# EAGLE design strip_charlie_30 (EAGLE 5.11)
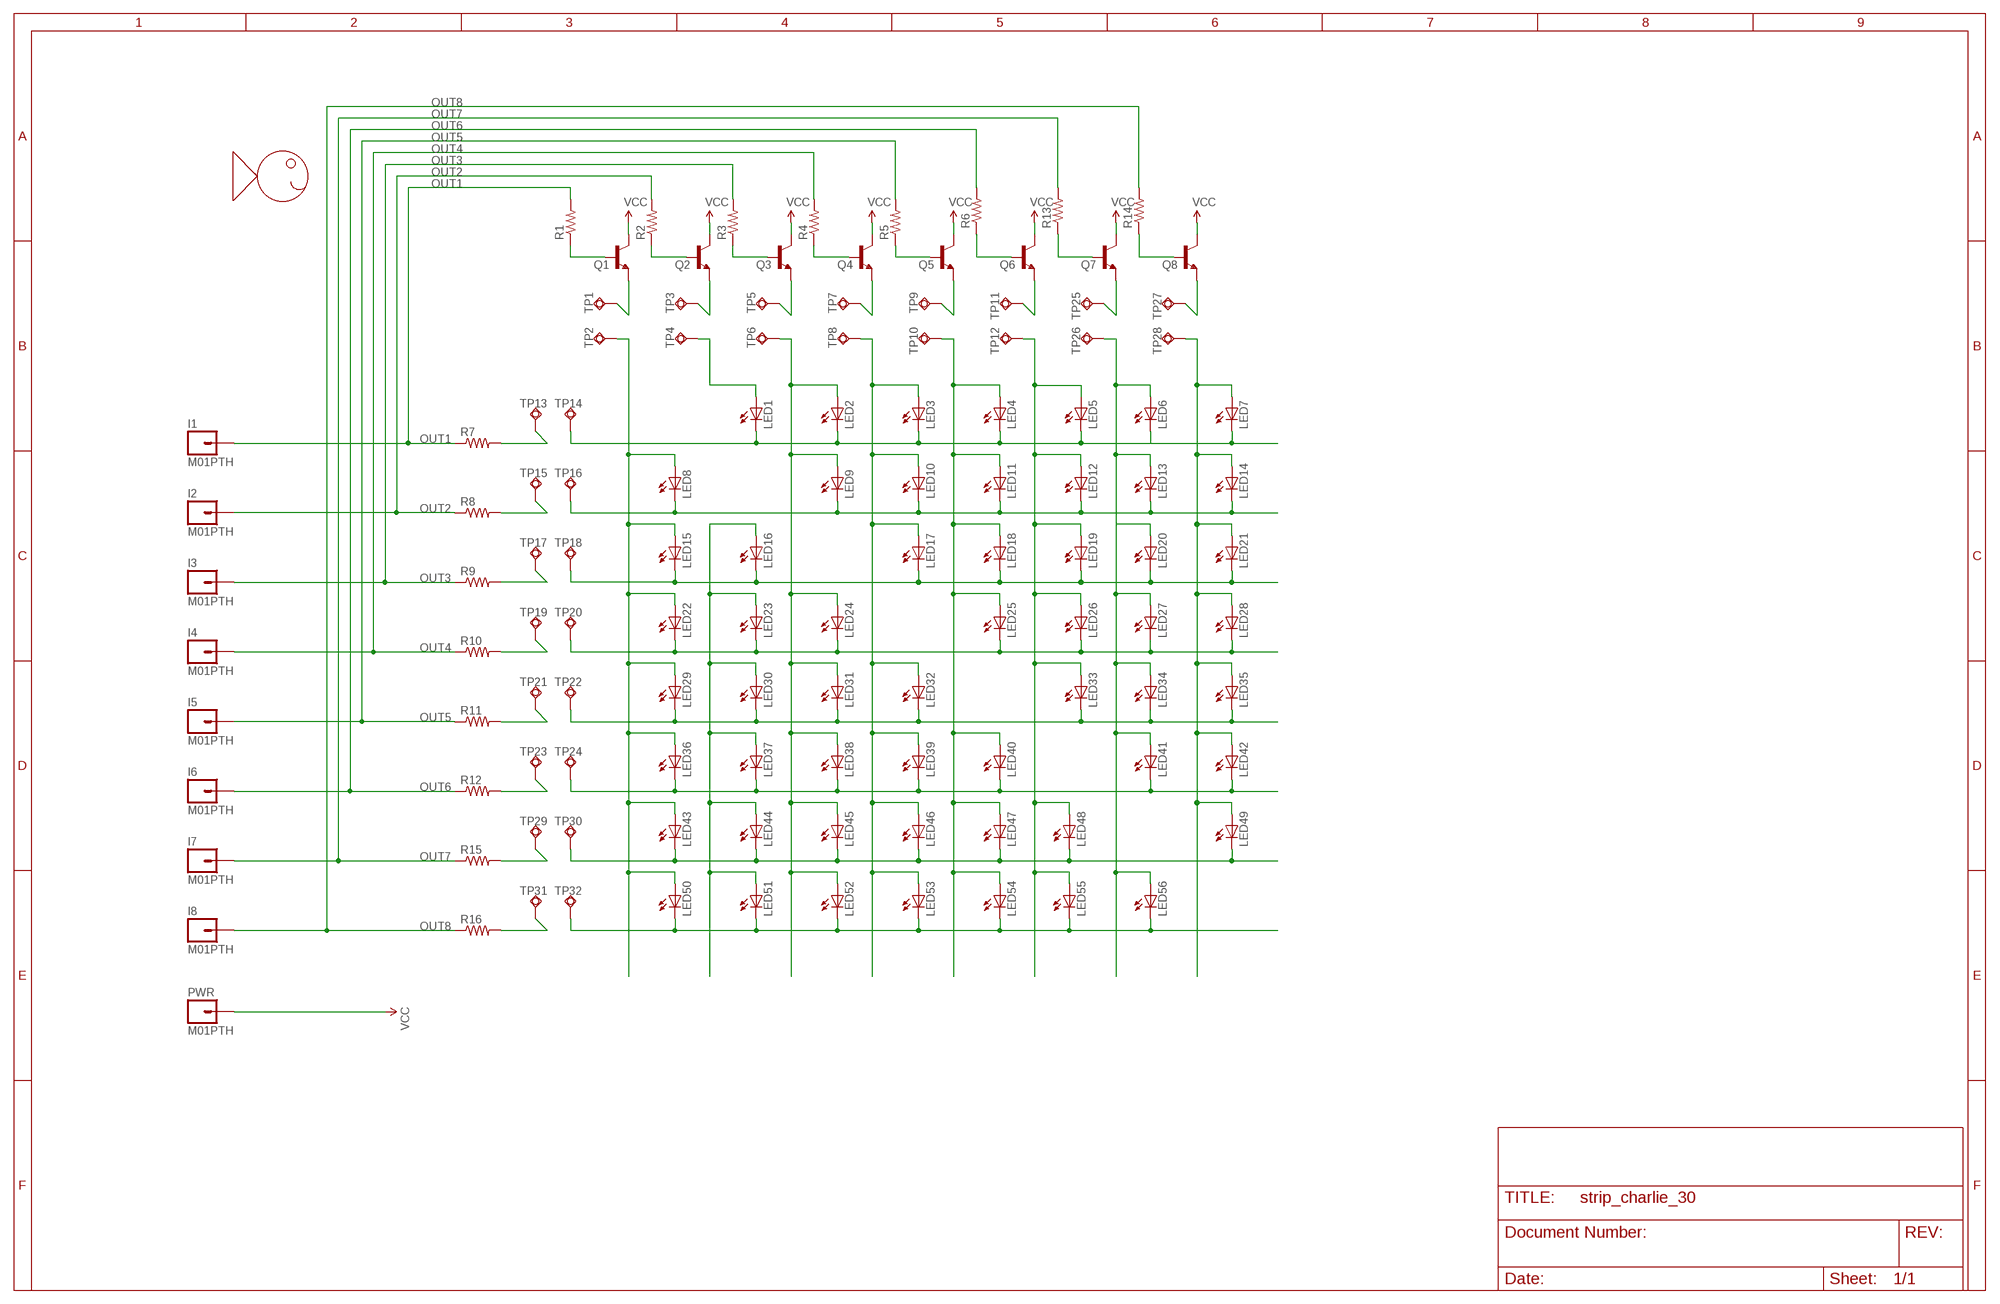
[diagram p0: schematic, sheet 1]

## Parts
I1  M01PTH  [1X01]
I2  M01PTH  [1X01]
I3  M01PTH  [1X01]
I4  M01PTH  [1X01]
I5  M01PTH  [1X01]
I6  M01PTH  [1X01]
I7  M01PTH  [1X01]
I8  M01PTH  [1X01]
LED1  LED1206  [LED-1206]
LED2  LED1206  [LED-1206]
LED3  LED1206  [LED-1206]
LED4  LED1206  [LED-1206]
LED5  LED1206  [LED-1206]
LED6  LED1206  [LED-1206]
LED7  LED1206  [LED-1206]
LED8  LED1206  [LED-1206]
LED9  LED1206  [LED-1206]
LED10  LED1206  [LED-1206]
LED11  LED1206  [LED-1206]
LED12  LED1206  [LED-1206]
LED13  LED1206  [LED-1206]
LED14  LED1206  [LED-1206]
LED15  LED1206  [LED-1206]
LED16  LED1206  [LED-1206]
LED17  LED1206  [LED-1206]
LED18  LED1206  [LED-1206]
LED19  LED1206  [LED-1206]
LED20  LED1206  [LED-1206]
LED21  LED1206  [LED-1206]
LED22  LED1206  [LED-1206]
LED23  LED1206  [LED-1206]
LED24  LED1206  [LED-1206]
LED25  LED1206  [LED-1206]
LED26  LED1206  [LED-1206]
LED27  LED1206  [LED-1206]
LED28  LED1206  [LED-1206]
LED29  LED1206  [LED-1206]
LED30  LED1206  [LED-1206]
LED31  LED1206  [LED-1206]
LED32  LED1206  [LED-1206]
LED33  LED1206  [LED-1206]
LED34  LED1206  [LED-1206]
LED35  LED1206  [LED-1206]
LED36  LED1206  [LED-1206]
LED37  LED1206  [LED-1206]
LED38  LED1206  [LED-1206]
LED39  LED1206  [LED-1206]
LED40  LED1206  [LED-1206]
LED41  LED1206  [LED-1206]
LED42  LED1206  [LED-1206]
LED43  LED1206  [LED-1206]
LED44  LED1206  [LED-1206]
LED45  LED1206  [LED-1206]
LED46  LED1206  [LED-1206]
LED47  LED1206  [LED-1206]
LED48  LED1206  [LED-1206]
LED49  LED1206  [LED-1206]
LED50  LED1206  [LED-1206]
LED51  LED1206  [LED-1206]
LED52  LED1206  [LED-1206]
LED53  LED1206  [LED-1206]
LED54  LED1206  [LED-1206]
LED55  LED1206  [LED-1206]
LED56  LED1206  [LED-1206]
PWR  M01PTH  [1X01]
Q1  TRANSISTOR_NPNSOT23-3  [SOT23-3]
Q2  TRANSISTOR_NPNSOT23-3  [SOT23-3]
Q3  TRANSISTOR_NPNSOT23-3  [SOT23-3]
Q4  TRANSISTOR_NPNSOT23-3  [SOT23-3]
Q5  TRANSISTOR_NPNSOT23-3  [SOT23-3]
Q6  TRANSISTOR_NPNSOT23-3  [SOT23-3]
Q7  TRANSISTOR_NPNSOT23-3  [SOT23-3]
Q8  TRANSISTOR_NPNSOT23-3  [SOT23-3]
R1  RESISTORR0805  [R0805]
R2  RESISTORR0805  [R0805]
R3  RESISTORR0805  [R0805]
R4  RESISTORR0805  [R0805]
R5  RESISTORR0805  [R0805]
R6  RESISTORR0805  [R0805]
R7  RESISTORR0805  [R0805]
R8  RESISTORR0805  [R0805]
R9  RESISTORR0805  [R0805]
R10  RESISTORR0805  [R0805]
R11  RESISTORR0805  [R0805]
R12  RESISTORR0805  [R0805]
R13  RESISTORR0805  [R0805]
R14  RESISTORR0805  [R0805]
R15  RESISTORR0805  [R0805]
R16  RESISTORR0805  [R0805]
TP1  TPSQTP20SQ  [TP20SQ]
TP2  TPSQTP20SQ  [TP20SQ]
TP3  TPSQTP20SQ  [TP20SQ]
TP4  TPSQTP20SQ  [TP20SQ]
TP5  TPSQTP20SQ  [TP20SQ]
TP6  TPSQTP20SQ  [TP20SQ]
TP7  TPSQTP20SQ  [TP20SQ]
TP8  TPSQTP20SQ  [TP20SQ]
TP9  TPSQTP20SQ  [TP20SQ]
TP10  TPSQTP20SQ  [TP20SQ]
TP11  TPSQTP20SQ  [TP20SQ]
TP12  TPSQTP20SQ  [TP20SQ]
TP13  TPSQTP20SQ  [TP20SQ]
TP14  TPSQTP20SQ  [TP20SQ]
TP15  TPSQTP20SQ  [TP20SQ]
TP16  TPSQTP20SQ  [TP20SQ]
TP17  TPSQTP20SQ  [TP20SQ]
TP18  TPSQTP20SQ  [TP20SQ]
TP19  TPSQTP20SQ  [TP20SQ]
TP20  TPSQTP20SQ  [TP20SQ]
TP21  TPSQTP20SQ  [TP20SQ]
TP22  TPSQTP20SQ  [TP20SQ]
TP23  TPSQTP20SQ  [TP20SQ]
TP24  TPSQTP20SQ  [TP20SQ]
TP25  TPSQTP20SQ  [TP20SQ]
TP26  TPSQTP20SQ  [TP20SQ]
TP27  TPSQTP20SQ  [TP20SQ]
TP28  TPSQTP20SQ  [TP20SQ]
TP29  TPSQTP20SQ  [TP20SQ]
TP30  TPSQTP20SQ  [TP20SQ]
TP31  TPSQTP20SQ  [TP20SQ]
TP32  TPSQTP20SQ  [TP20SQ]
U$1  FHI_LOGO  [FHI_LOGO]

## Nets
N$1: Q7.1(B) R13.1
N$2: Q8.1(B) R14.1
N$11: Q6.1(B) R6.1
N$14: LED16.A LED23.A LED30.A LED37.A LED44.A LED51.A
N$15: Q1.1(B) R1.1
N$16: Q2.1(B) R2.1
N$17: Q3.1(B) R3.1
N$18: Q4.1(B) R4.1
N$19: Q5.1(B) R5.1
OUT1: I1.1 R1.2 R7.1
OUT1_1: Q1.2(E) TP1.TP
OUT1_2: LED8.A LED15.A LED22.A LED29.A LED36.A LED43.A LED50.A TP2.TP
OUT1_3: R7.2 TP13.TP
OUT1_4: LED1.C LED2.C LED3.C LED4.C LED5.C LED6.C LED7.C TP14.TP
OUT2: I2.1 R2.2 R8.1
OUT2_1: Q2.2(E) TP3.TP
OUT2_2: LED1.A TP4.TP
OUT2_3: R8.2 TP15.TP
OUT2_4: LED8.C LED9.C LED10.C LED11.C LED12.C LED13.C LED14.C TP16.TP
OUT3: I3.1 R3.2 R9.1
OUT3_1: Q3.2(E) TP5.TP
OUT3_2: LED2.A LED9.A LED24.A LED31.A LED38.A LED45.A LED52.A TP6.TP
OUT3_3: R9.2 TP17.TP
OUT3_4: LED15.C LED16.C LED17.C LED18.C LED19.C LED20.C LED21.C TP18.TP
OUT4: I4.1 R4.2 R10.1
OUT4_1: Q4.2(E) TP7.TP
OUT4_2: LED3.A LED10.A LED17.A LED32.A LED39.A LED46.A LED53.A TP8.TP
OUT4_3: R10.2 TP19.TP
OUT4_4: LED22.C LED23.C LED24.C LED25.C LED26.C LED27.C LED28.C TP20.TP
OUT5: I5.1 R5.2 R11.1
OUT5_1: Q5.2(E) TP9.TP
OUT5_2: LED4.A LED11.A LED18.A LED25.A LED40.A LED47.A LED54.A TP10.TP
OUT5_3: R11.2 TP21.TP
OUT5_4: LED29.C LED30.C LED31.C LED32.C LED33.C LED34.C LED35.C TP22.TP
OUT6: I6.1 R6.2 R12.1
OUT6_1: Q6.2(E) TP11.TP
OUT6_2: LED5.A LED12.A LED19.A LED26.A LED33.A LED48.A LED55.A TP12.TP
OUT6_3: R12.2 TP23.TP
OUT6_4: LED36.C LED37.C LED38.C LED39.C LED40.C LED41.C LED42.C TP24.TP
OUT7: I7.1 R13.2 R15.1
OUT7_1: Q7.2(E) TP25.TP
OUT7_2: LED6.A LED13.A LED20.A LED27.A LED34.A LED41.A LED56.A TP26.TP
OUT7_3: R15.2 TP29.TP
OUT7_4: LED43.C LED44.C LED45.C LED46.C LED47.C LED48.C LED49.C TP30.TP
OUT8: I8.1 R14.2 R16.1
OUT8_1: Q8.2(E) TP27.TP
OUT8_2: LED7.A LED14.A LED21.A LED28.A LED35.A LED42.A LED49.A TP28.TP
OUT8_3: R16.2 TP31.TP
OUT8_4: LED50.C LED51.C LED52.C LED53.C LED54.C LED55.C LED56.C TP32.TP
VCC: PWR.1 Q1.3(C) Q2.3(C) Q3.3(C) Q4.3(C) Q5.3(C) Q6.3(C) Q7.3(C) Q8.3(C)

## Library data of the parts
I1-I8 PWR = SparkFun:M01: Header 1 Standard 1-pin 0.1" header. Use with straight break away headers (SKU : PRT-00116), right angle break away headers (PRT-00553), swiss pins (PRT-00743), machine pins (PRT-00117), and female headers (PRT-00115).
LED1-LED56 = CyberRailGuru:LED: LEDs Standard schematic elements and footprints for 5mm, 3mm, 1206, and 0603 sized LEDs. 5mm - Spark Fun Electronics SKU : COM-00529 (and others)
Q1-Q8 = SparkFun:TRANSISTOR_NPN: Transistor NPN BJT configuration in SOT23 package. MMBT2222 is the common NPN we use. Double check BCE configuration again layout.
R1-R16 = CyberRailGuru:RESISTOR: RESISTOR, American symbol
TP1-TP32 = CyberRailGuru:TPSQ: Test pad
U$1 = CyberRailGuru:FHI_LOGO: Fishhead Industries Logo

## Board
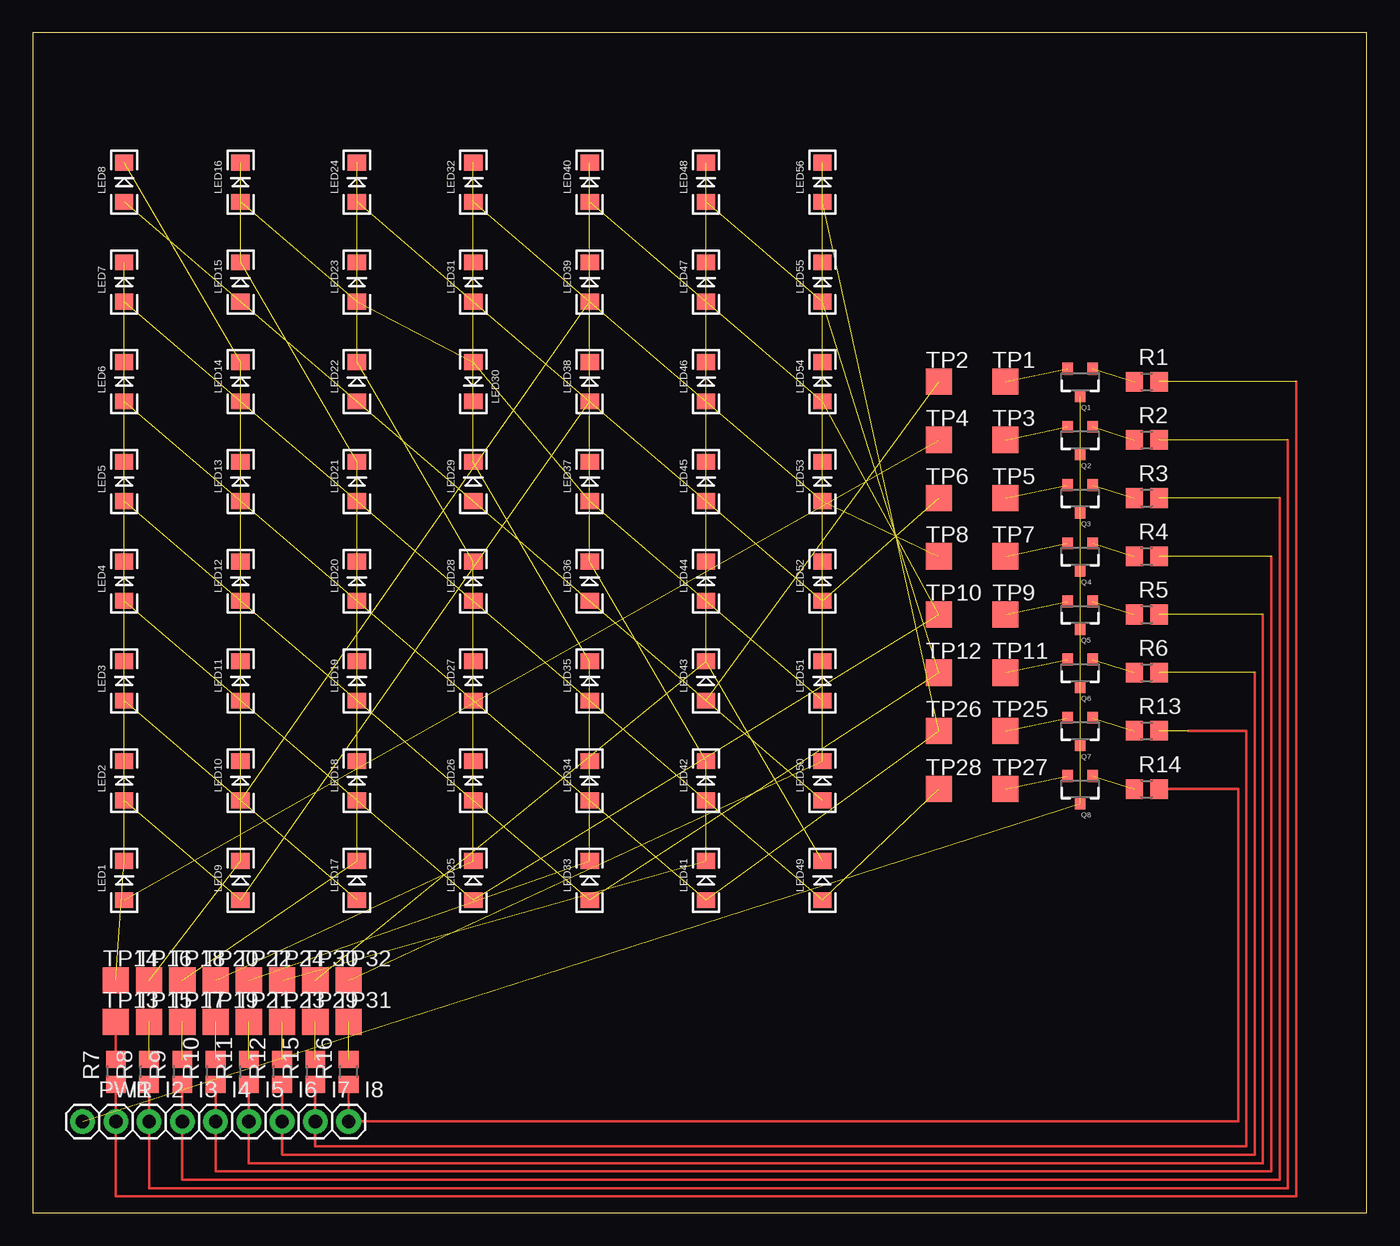
[diagram p1: board, top side]

Size 101.91 x 90.16 mm. Coordinates in mm from the lower left corner, seen from the top.
Outline: 0,0 101.91,0 101.91,90.16 0,90.16 0,0
Copper layers (1*16): Top 0.035mm / dielectric 1.5mm / Bottom 0.035mm
Design rules "default *": minimum track width 8mil, minimum drill 20mil, track to track 8mil, track to pad 8mil, pad to pad 8mil, via to via 8mil, smd to smd 8mil, copper to edge 40mil, drill to drill 8mil, minimum pad ring 10mil, minimum via ring 8mil, stop-mask expansion 4mil, vias tented up to drill 0mil, thermal gap 10mil

### Footprints (pad centres in the part's own frame; a part is rotated, then mirrored left to right if it is on the bottom)
1X01 = drill 1.016 pad 1.88 round: 1 0,0
LED-1206 = smd 1.2 x 1.4: A -1.5,0; C 1.5,0
SOT23-3 = smd 0.8 x 0.9: 1 -0.95,-1; 2 0.95,-1; 3 0,1.1
R0805 = smd 1.3 x 1.5: 1 -0.95,0; 2 0.95,0
TP20SQ = smd 2 x 2: TP 0,0

### Placement (x,y rotation side)
I1  6.35,6.99 0 top
I2  8.89,6.99 0 top
I3  11.43,6.99 0 top
I4  13.97,6.99 0 top
I5  16.51,6.99 0 top
I6  19.05,6.99 0 top
I7  21.59,6.99 0 top
I8  24.13,6.99 0 top
LED1  6.99,25.4 90 top
LED2  6.99,33.02 90 top
LED3  6.99,40.64 90 top
LED4  6.99,48.26 90 top
LED5  6.99,55.88 90 top
LED6  6.99,63.5 90 top
LED7  6.99,71.12 90 top
LED8  6.99,78.74 90 top
LED9  15.88,25.4 90 top
LED10  15.88,33.02 90 top
LED11  15.88,40.64 90 top
LED12  15.88,48.26 90 top
LED13  15.88,55.88 90 top
LED14  15.88,63.5 90 top
LED15  15.88,71.12 90 top
LED16  15.88,78.74 90 top
LED17  24.77,25.4 90 top
LED18  24.77,33.02 90 top
LED19  24.77,40.64 90 top
LED20  24.77,48.26 90 top
LED21  24.77,55.88 90 top
LED22  24.77,63.5 90 top
LED23  24.77,71.12 90 top
LED24  24.77,78.74 90 top
LED25  33.66,25.4 90 top
LED26  33.66,33.02 90 top
LED27  33.66,40.64 90 top
LED28  33.66,48.26 90 top
LED29  33.66,55.88 90 top
LED30  33.66,63.5 270 top
LED31  33.66,71.12 90 top
LED32  33.66,78.74 90 top
LED33  42.55,25.4 90 top
LED34  42.55,33.02 90 top
LED35  42.55,40.64 90 top
LED36  42.55,48.26 90 top
LED37  42.55,55.88 90 top
LED38  42.55,63.5 90 top
LED39  42.55,71.12 90 top
LED40  42.55,78.74 90 top
LED41  51.44,25.4 90 top
LED42  51.44,33.02 90 top
LED43  51.44,40.64 90 top
LED44  51.44,48.26 90 top
LED45  51.44,55.88 90 top
LED46  51.44,63.5 90 top
LED47  51.44,71.12 90 top
LED48  51.44,78.74 90 top
LED49  60.33,25.4 90 top
LED50  60.33,33.02 90 top
LED51  60.33,40.64 90 top
LED52  60.33,48.26 90 top
LED53  60.33,55.88 90 top
LED54  60.33,63.5 90 top
LED55  60.33,71.12 90 top
LED56  60.33,78.74 90 top
PWR  3.81,6.99 0 top
Q1  80.01,63.5 180 top
Q2  80.01,59.05 180 top
Q3  80.01,54.61 180 top
Q4  80.01,50.16 180 top
Q5  80.01,45.72 180 top
Q6  80.01,41.27 180 top
Q7  80.01,36.83 180 top
Q8  80.01,32.38 180 top
R1  85.09,63.5 0 top
R2  85.09,59.05 0 top
R3  85.09,54.61 0 top
R4  85.09,50.16 0 top
R5  85.09,45.72 0 top
R6  85.09,41.27 0 top
R7  6.35,10.79 90 top
R8  8.89,10.79 90 top
R9  11.43,10.79 90 top
R10  13.97,10.79 90 top
R11  16.51,10.79 90 top
R12  19.05,10.79 90 top
R13  85.09,36.83 0 top
R14  85.09,32.38 0 top
R15  21.59,10.79 90 top
R16  24.13,10.79 90 top
TP1  74.3,63.5 0 top
TP2  69.22,63.5 0 top
TP3  74.3,59.05 0 top
TP4  69.22,59.05 0 top
TP5  74.3,54.61 0 top
TP6  69.22,54.61 0 top
TP7  74.3,50.16 0 top
TP8  69.22,50.16 0 top
TP9  74.3,45.72 0 top
TP10  69.22,45.72 0 top
TP11  74.3,41.27 0 top
TP12  69.22,41.27 0 top
TP13  6.35,14.61 0 top
TP14  6.35,17.78 0 top
TP15  8.89,14.61 0 top
TP16  8.89,17.78 0 top
TP17  11.43,14.61 0 top
TP18  11.43,17.78 0 top
TP19  13.97,14.61 0 top
TP20  13.97,17.78 0 top
TP21  16.51,14.61 0 top
TP22  16.51,17.78 0 top
TP23  19.05,14.61 0 top
TP24  19.05,17.78 0 top
TP25  74.3,36.83 0 top
TP26  69.22,36.83 0 top
TP27  74.3,32.38 0 top
TP28  69.22,32.38 0 top
TP29  21.59,14.61 0 top
TP30  21.59,17.78 0 top
TP31  24.13,14.61 0 top
TP32  24.13,17.78 0 top
U$1  -15.24,48.26 0 top  (outside the outline)

### Tracks (layer width: path | path; a pad name or v marks a point on that pad's centre or on a via)
N$1  (1 unrouted)
N$2  (1 unrouted)
N$11  (1 unrouted)
N$14  (5 unrouted)
N$15  (1 unrouted)
N$16  (1 unrouted)
N$17  (1 unrouted)
N$18  (1 unrouted)
N$19  (1 unrouted)
OUT1  (1 unrouted)
  Top 0.203: I1.1 R7.1 6.35,1.27 96.52,1.27 96.52,63.5
OUT1_1  (1 unrouted)
OUT1_2  (7 unrouted)
OUT1_3
  Top 0.203: R7.2 TP13.TP
OUT1_4  (7 unrouted)
OUT2  (1 unrouted)
  Top 0.203: I2.1 R8.1 8.89,1.91 95.89,1.91 95.89,59.05
OUT2_1  (1 unrouted)
OUT2_2  (1 unrouted)
OUT2_3  (1 unrouted)
OUT2_4  (7 unrouted)
OUT3  (1 unrouted)
  Top 0.203: I3.1 R9.1 11.43,2.54 95.25,2.54 95.25,54.61
OUT3_1  (1 unrouted)
OUT3_2  (7 unrouted)
OUT3_3  (1 unrouted)
OUT3_4  (7 unrouted)
OUT4  (1 unrouted)
  Top 0.203: I4.1 R10.1 13.97,3.17 94.61,3.17 94.61,50.16
OUT4_1  (1 unrouted)
OUT4_2  (7 unrouted)
OUT4_3  (1 unrouted)
OUT4_4  (7 unrouted)
OUT5  (1 unrouted)
  Top 0.203: I5.1 R11.1 16.51,3.81 93.98,3.81 93.98,45.72
OUT5_1  (1 unrouted)
OUT5_2  (7 unrouted)
OUT5_3  (1 unrouted)
OUT5_4  (7 unrouted)
OUT6  (1 unrouted)
  Top 0.203: I6.1 R12.1 19.05,4.45 93.34,4.45 93.34,41.27
OUT6_1  (1 unrouted)
OUT6_2  (7 unrouted)
OUT6_3  (1 unrouted)
OUT6_4  (7 unrouted)
OUT7  (1 unrouted)
  Top 0.203: I7.1 R15.1 21.59,5.08 92.71,5.08 92.71,36.83 88.27,36.83
OUT7_1  (1 unrouted)
OUT7_2  (7 unrouted)
OUT7_3  (1 unrouted)
OUT7_4  (7 unrouted)
OUT8
  Top 0.203: R16.1 I8.1 92.08,6.99 92.08,32.38 R14.2
OUT8_1  (1 unrouted)
OUT8_2  (7 unrouted)
OUT8_3  (1 unrouted)
OUT8_4  (7 unrouted)
VCC  (8 unrouted)